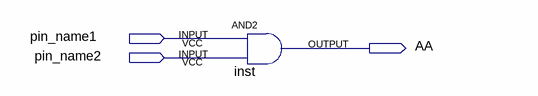
[diagram p0: schematic sheet]
// Quartus schematic ReverseCounter.bdf as structural Verilog: 1 symbols, 3 pins
module ReverseCounter (
  input  pin_name1,
  input  pin_name2,
  output AA
);

  and inst (AA, pin_name1, pin_name2);
endmodule
